# EAGLE design ReSpeaker_HPF_V01 (EAGLE 8.3.2)
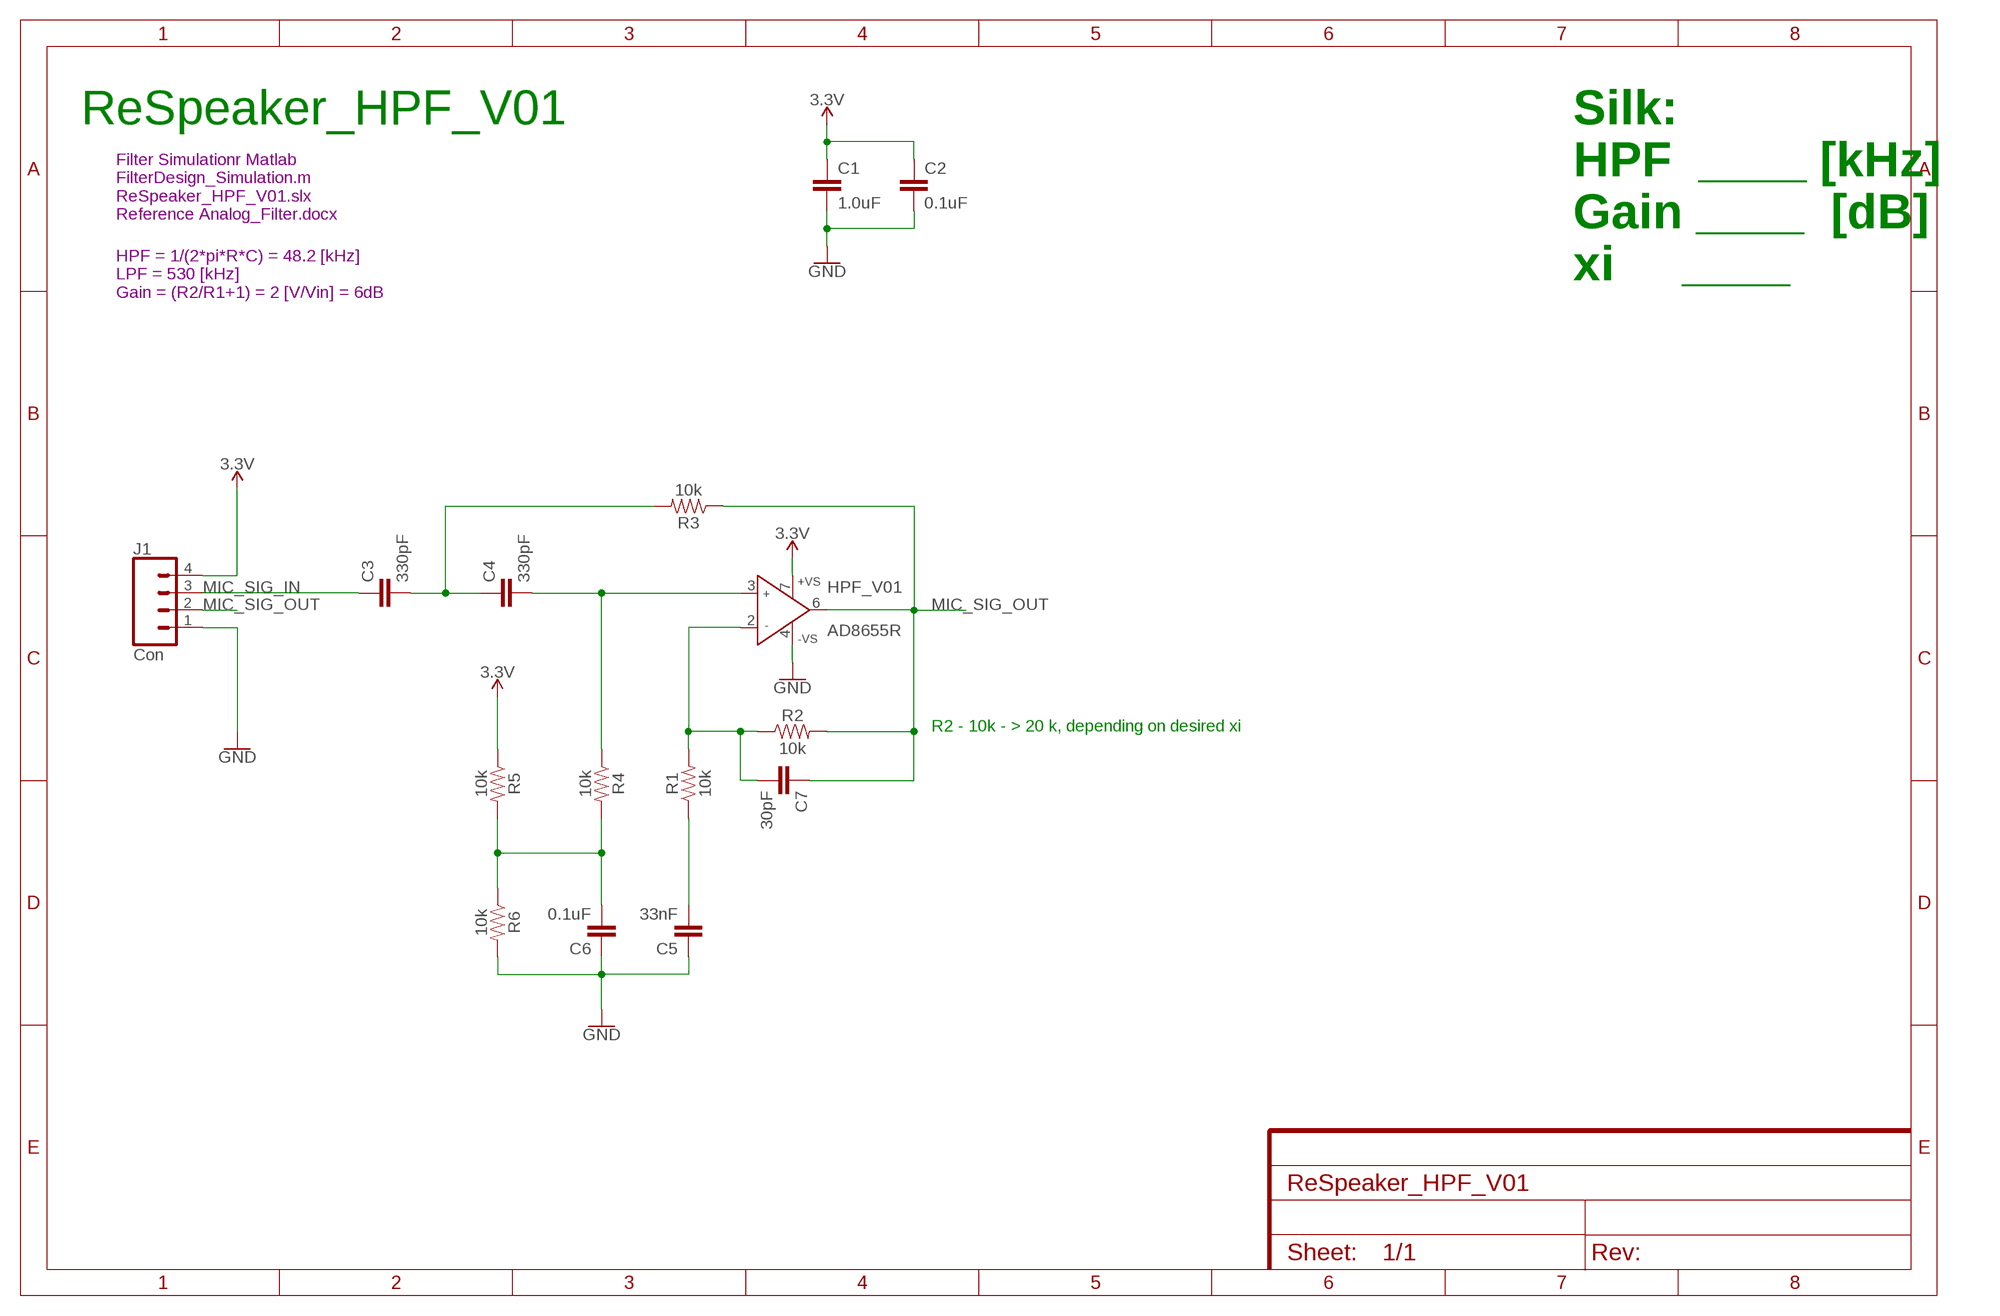
[diagram p0: schematic, sheet 1]

## Parts
C1  1.0uF  1.0UF-0805-25V-10%  [0805]
C2  0.1uF  1.0UF-0805-25V-10%  [0805]
C3  330pF  1.0UF-0805-25V-10%  [0805]
C4  330pF  1.0UF-0805-25V-10%  [0805]
C5  33nF  1.0UF-0805-25V-10%  [0805]
C6  0.1uF  1.0UF-0805-25V-10%  [0805]
C7  30pF  1.0UF-0805-25V-10%  [0805]
HPF_V01  AD8655R  [SO8]
J1  Con  CONN_04  [1X04]
R1  10k  RESISTOR0805  [0805]
R2  10k  RESISTOR0805  [0805]
R3  10k  RESISTOR0805  [0805]
R4  10k  RESISTOR0805  [0805]
R5  10k  RESISTOR0805  [0805]
R6  10k  RESISTOR0805  [0805]

## Nets
3.3V: C1.1 C2.1 HPF_V01.7(+VS) J1.4 R5.1
GND: C1.2 C2.2 C5.1 C6.1 HPF_V01.4(-VS) J1.1 R6.2
MIC_SIG_IN: C3.1 J1.3
MIC_SIG_OUT: C7.1 HPF_V01.6(OUT) J1.2 R2.2 R3.1
N$1: C3.2 C4.1 R3.2
N$2: C4.2 HPF_V01.3(IN+) R4.1
N$4: C7.2 HPF_V01.2(IN-) R1.2 R2.1
N$5: C5.2 R1.1
N$9: C6.2 R4.2 R5.2 R6.1

## Notes on the sheet
- ReSpeaker_HPF_V01
- Filter Simulationr Matlab
  FilterDesign_Simulation.m
  ReSpeaker_HPF_V01.slx
  Reference Analog_Filter.docx
- Silk:
  HPF  ____ [kHz]
  Gain ____  [dB]
  xi     ____
- HPF = 1/(2*pi*R*C) = 48.2 [kHz]
  LPF = 530 [kHz]
  Gain = (R2/R1+1) = 2 [V/Vin] = 6dB
- R2 - 10k - > 20 k, depending on desired xi

## Library data of the parts
C1 = SparkFun-Capacitors:1.0UF: 1µF ceramic capacitors A capacitor is a passive two-terminal electrical component used to store electrical energy temporarily in an electric field.; PROD_ID: CAP-08064
C2-C7 = SparkFun-Capacitors:1.0UF: 1µF ceramic capacitors A capacitor is a passive two-terminal electrical component used to store electrical energy temporarily in an electric field.; PROD_ID: CAP-08064; VALUE: 1.0uF
HPF_V01 = analog-devices:AD8655: Low Noise, Precision CMOS Amplifier Source: http://www.analog.com/static/imported-files/data_sheets/AD8655_8656.pdf; MF: ALTERA CORPORATION; MPN: AD8655ARMZ-REEL; OC_FARNELL: 1078267; OC_NEWARK: 59K7050
J1 = SparkFun-Connectors:CONN_04: Multi connection point. Often used as Generic Header-pin footprint for 0.1 inch spaced/style header connections On any of the 0.1 inch spaced packages, you can populate with these: Break Away Headers - Straight <https://www.sparkfun.com/products/116> (PRT-00116) Break Away Male Headers - Right Angle <https://www.sparkfun.com/products/553> (PRT-00553) Female Headers <https://www.sparkfun.com/products/115> (PRT-00115) Break Away Headers - Machine Pin <https://www.sparkfun.com/products/117> (PRT-00117) Break Away Female Headers - Swiss Machine Pin <https://www.sparkfun.com/products/743> (PRT-00743) For SCREWTERMINALS and SPRING TERMINALS visit here: Screw Terimnals on SparkFun.com <https://www.sparkfun.com/search/results?term=Screw+Terminals> (5mm/3.5mm/2.54mm spacing) This device is also useful as a general connection point to wire up your design to another part of your project. Our various solder wires solder well into these plated through hole pads. Hook-Up Wire - Assortment (Stranded, 22 AWG) <https://www.sparkfun.com/products/11375> (PRT-11375) Hook-Up Wire - Assortment (Solid Core, 22 AWG) <https://www.sparkfun.com/products/11367> (PRT-11367) View the entire wire category on our website here <https://www.sparkfun.com/categories/141> Special notes: Molex polarized connector foot print use with SKU : PRT-08231 with associated crimp pins and housings. 1MM SMD Version SKU: PRT-10208; PROD_ID: CONN-09696
R1-R6 = SparkFun-Resistors:RESISTOR: Generic Resistor Package

## Net classes
0 default: width 0.254 mm, drill 0.3 mm, clearance 0.203 mm

## Board
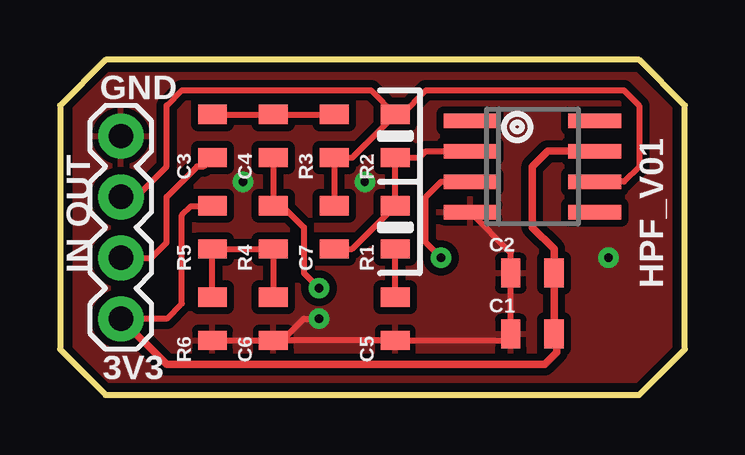
[diagram p1: board, top side]
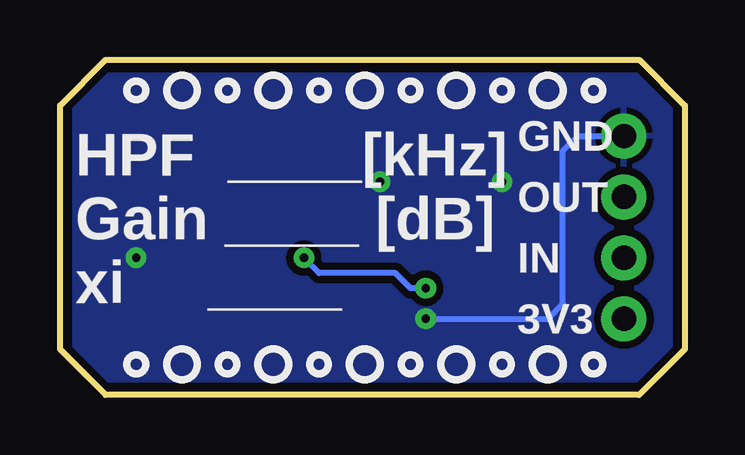
[diagram p2: board, bottom side, seen from below]

Size 26.04 x 13.97 mm. Coordinates in mm from the lower left corner, seen from the top.
Outline: 1.91,0 24.13,0 26.04,1.91 26.04,12.06 24.13,13.97 1.91,13.97 0,12.06 0,1.91 1.91,0
Copper layers (1*16): Top 0.035mm / dielectric 1.5mm / Bottom 0.035mm
Design rules "Modified-SparkFun-2-layer-STANDARD": minimum track width 8mil, minimum drill 0.3mm, track to track 10mil, track to pad 8mil, pad to pad 8mil, via to via 10mil, smd to smd 8mil, copper to edge 8mil, drill to drill 8mil, minimum pad ring 10mil, minimum via ring 10mil, stop-mask expansion 4mil, vias tented up to drill 25mil, thermal gap 10mil

### Footprints (pad centres in the part's own frame; a part is rotated, then mirrored left to right if it is on the bottom)
0805 = smd 0.8 x 1.2: 1 -0.9,0; 2 0.9,0
SO8 = smd 0.6 x 2.2: 1 -1.905,-2.6; 2 -0.635,-2.6; 3 0.635,-2.6; 4 1.905,-2.6; 5 1.905,2.6; 6 0.635,2.6; 7 -0.635,2.6; 8 -1.905,2.6
1X04 = drill 1.016 pad 1.88: 1 0,0; 2 2.54,0; 3 5.08,0; 4 7.62,0

### Placement (x,y rotation side)
C1  19.68,2.54 180 top
C2  19.68,5.08 180 top
C3  6.35,10.79 90 top
C4  8.89,10.79 270 top
C5  13.97,3.17 90 top
C6  8.89,3.17 90 top
C7  11.43,6.99 270 top
HPF_V01  19.68,9.53 270 top
J1  2.54,10.79 270 top
R1  13.97,6.99 90 top
R2  13.97,10.79 90 top
R3  11.43,10.79 90 top
R4  8.89,6.99 270 top
R5  6.35,6.99 270 top
R6  6.35,3.17 270 top

### Tracks (layer width: path | path; a pad name or v marks a point on that pad's centre or on a via)
3.3V
  Top 0.254: J1.4 4.45,3.17 5.08,3.81 5.08,7.49 5.46,7.87 6.34,7.87 R5.1
  Top 0.305: J1.4 4.45,1.27 20.19,1.27 20.7,1.78 20.7,2.42 C1.1 C2.1 20.59,6.08 19.68,6.99 19.68,9.53 20.32,10.16 HPF_V01.7
GND  (via drill 0.35)
  Top 0.254: R6.2 C6.1 | C6.1 C5.1 18.52,2.27 C1.2 C2.2 18.79,5.92 HPF_V01.4 | C6.1 9.26,2.27 10.16,3.17 v10.79,3.17
  Bottom 0.254: v10.79,3.17 5.71,3.17 5.08,3.81 5.08,10.16 4.45,10.79 J1.1
  other vias: 7.62,8.89 22.86,5.71 12.7,8.89
  pour Bottom (isolate 0.305): 0.64,0.64 25.4,0.64 25.4,13.34 0.64,13.34
  pour Top (isolate 0.305): 0.64,0.64 25.4,0.64 25.4,13.34 0.64,13.34
MIC_SIG_IN
  Top 0.254: J1.3 3.81,5.71 4.45,6.35 4.45,8.26 5.71,9.53 5.98,9.53 C3.1
MIC_SIG_OUT
  Top 0.254: C7.1 R3.1 12.17,9.89 R2.2 | J1.2 3.17,8.26 4.45,9.53 4.45,12.06 5.08,12.7 12.96,12.7 R2.2 | R2.2 14.23,11.7 15.24,12.7 23.5,12.7 24.13,12.06 24.13,9.53 23.5,8.89 HPF_V01.6
N$1
  Top 0.254: C3.2 C4.1 R3.2
N$2  (via drill 0.35)
  Top 0.254: C4.2 R4.1 9.26,7.88 10.16,6.99 10.16,5.08 v10.79,4.45 | HPF_V01.3 15.88,8.89 15.24,8.26 15.24,6.35 v15.88,5.71
  Bottom 0.254: v10.79,4.45 11.43,4.45 12.06,5.08 15.24,5.08 v15.88,5.71
N$4
  Top 0.254: C7.2 12.17,6.08 R1.2 R2.1 14.97,9.89 15.24,10.16 HPF_V01.2
N$5
  Top 0.254: C5.2 R1.1
N$9
  Top 0.254: R6.1 R5.2 R4.2 C6.2

### Text on the board
tPlace: GND | OUT | IN | 3V3
bPlace: GND | OUT | IN | HPF ____[kHz] / Gain ____ [dB] / xi ____ | 3V3